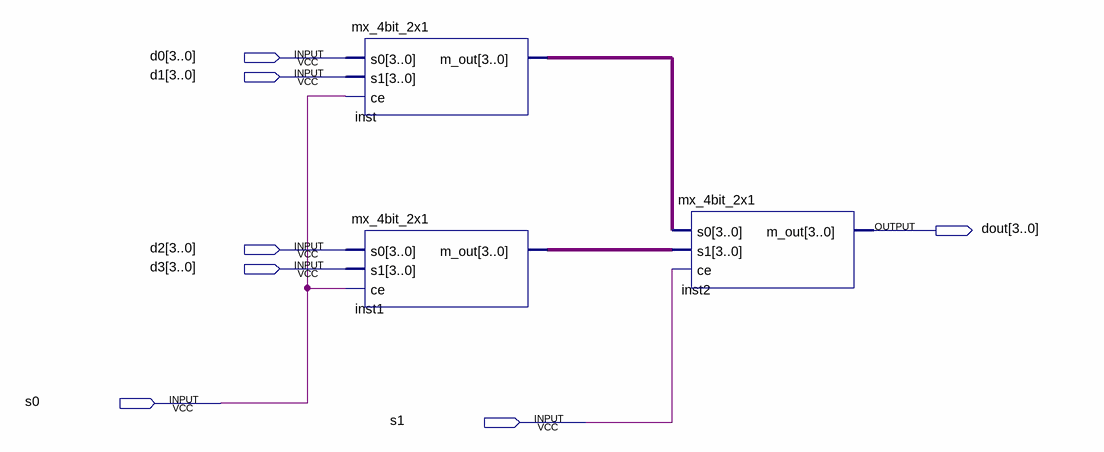
[diagram p0: schematic sheet]
// Quartus schematic mx_4bit_4x1.bdf as structural Verilog: 3 symbols, 7 pins
module mx_4bit_4x1 (
  input  [3:0] d0,
  input  [3:0] d1,
  input  [3:0] d2,
  input  [3:0] d3,
  input  s0,
  input  s1,
  output [3:0] dout
);

  wire [3:0] inst1_m_out, inst_m_out;

  mx_4bit_2x1 inst (.s0(d0), .s1(d1), .ce(s0), .m_out(inst_m_out));
  mx_4bit_2x1 inst1 (.s0(d2), .s1(d3), .ce(s0), .m_out(inst1_m_out));
  mx_4bit_2x1 inst2 (.s0(inst_m_out), .s1(inst1_m_out), .ce(s1), .m_out(dout));
endmodule
